# EAGLE design cerberus (EAGLE 7.5.0)
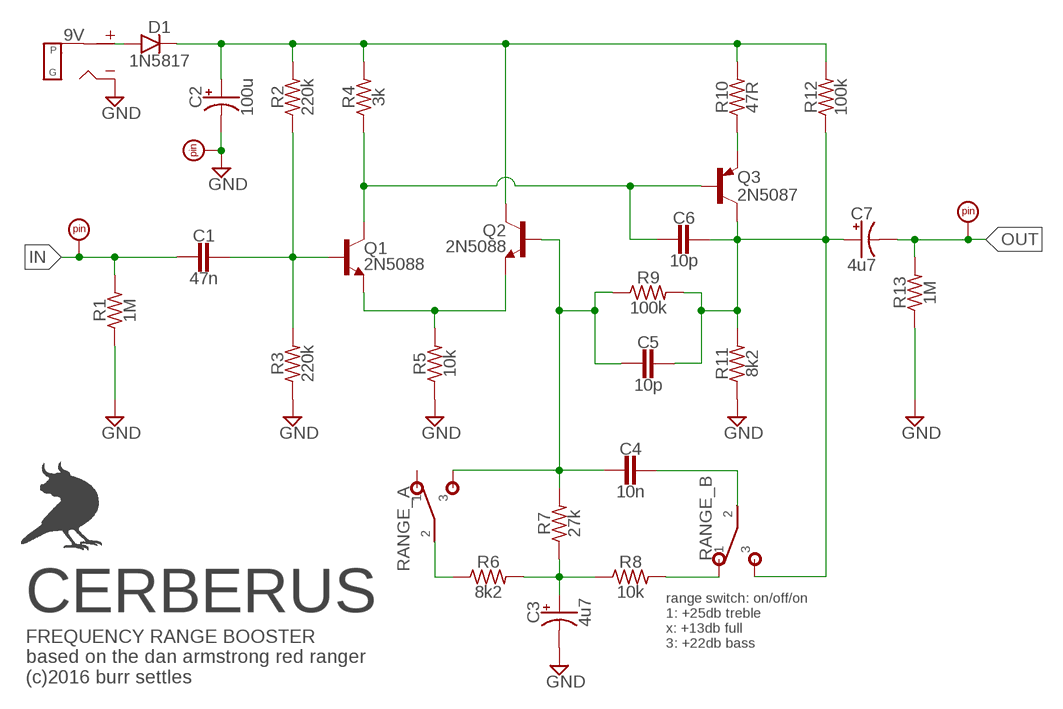
[diagram p0: schematic, sheet 1]

## Parts
9V  DC_MONO  [DC]
C1  47n  CER/FILMBOX.1  [BOX_SMALL]
C2  100u  0501  [050_020_1]
C3  4u7  0501  [050_020_1]
C4  10n  CER/FILMBOX.1  [BOX_SMALL]
C5  10p  CER/FILM2  [050X030_025_2]
C6  10p  CER/FILM2  [050X030_025_2]
C7  4u7  0501  [050_020_1]
D1  1N5817  DO41.3  [DO41-3]
GND  PADRND  [ROUND]
IN  PADSQR  [SQUARE]
OUT  PADSQR  [SQUARE]
Q1  2N5088  [TO92-]
Q2  2N5088  [TO92-]
Q3  2N5087  2N5087.1  [TO92-]
R1  1M  R_.3B  [R0207/3]
R2  220k  R_.3B  [R0207/3]
R3  220k  R_.3B  [R0207/3]
R4  3k  R_.3B  [R0207/3]
R5  10k  R_.3B  [R0207/3]
R6  8k2  R_.3B  [R0207/3]
R7  27k  R_.3B  [R0207/3]
R8  10k  R_.3B  [R0207/3]
R9  100k  R_.3B  [R0207/3]
R10  47R  R_.3B  [R0207/3]
R11  8k2  R_.3B  [R0207/3]
R12  100k  R_.3B  [R0207/3]
R13  1M  R_.3B  [R0207/3]
RANGE  DPDT  DPDTPADS  [DPDT_PADS]

## Nets
GND: 9V.S(SLEEVE) C2.- C3.- GND.1 R1.1 R3.1 R5.1 R11.1 R13.1
IN: C1.2 IN.1 R1.2
N$1: C1.1 Q1.2(B) R2.1 R3.2
N$2: Q3.3(E) R10.1
N$3: 9V.T(TIP) D1.A
N$4: C6.2 Q1.1(C) Q3.2(B) R4.1
N$5: Q1.3(E) Q2.3(E) R5.2
N$6: C5.1 C6.1 C7.+ Q3.1(C) R9.2 R11.2 R12.1 RANGE.P$6
N$7: C2.+ D1.C Q2.1(C) R2.2 R4.2 R10.2 R12.2
N$8: R6.1 RANGE.P$2
N$9: C4.1 RANGE.P$5
N$10: C4.2 C5.2 Q2.2(B) R7.2 R9.1 RANGE.P$3
N$12: C3.+ R6.2 R7.1 R8.1
N$14: R8.2 RANGE.P$4
OUT: C7.- OUT.1 R13.2
Unconnected: RANGE.P$1

## Notes on the sheet
- CERBERUS
- range switch: on/off/on
  1: +25db treble
  x: +13db full
  3: +22db bass
- FREQUENCY RANGE BOOSTER
  based on the dan armstrong red ranger
  (c)2016 burr settles

## Library data of the parts
9V = jacks:DC_MONO
C1 C4-C6 = capacitors-film:CER/FILM: 47 - 120pF Xicon Ceramic Disc 2.5mm lead spacing
C2 C3 C7 = capacitors-elec:050: 0.22 - 100uF Xicon values at Mouser.com: 10V: 10 - 100uF; 16V: 2.2 - 47uF; 25V: 0.47 - 47uF; 50V: 0.22 - 22uF
D1 = diodes:DO41: DO-41 Package Diodes: 1N4001 - 1N40019 Zener Diodes: 1N4728 - 1N4764
GND IN OUT = supply pins:PAD
Q1 Q2 = transistors:2N5088: NPN Transistor
Q3 = transistors:2N5087: PNP Transistor
R1-R13 = resistors:R_
RANGE = switches:DPDT

## Board
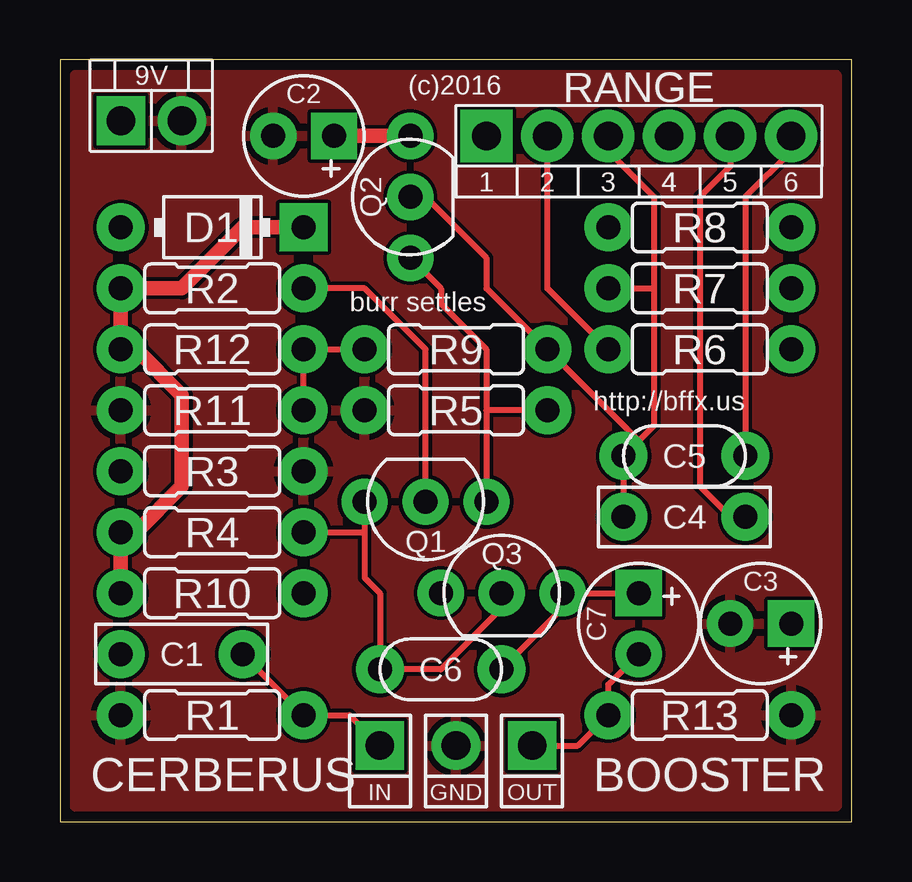
[diagram p1: board, top side]
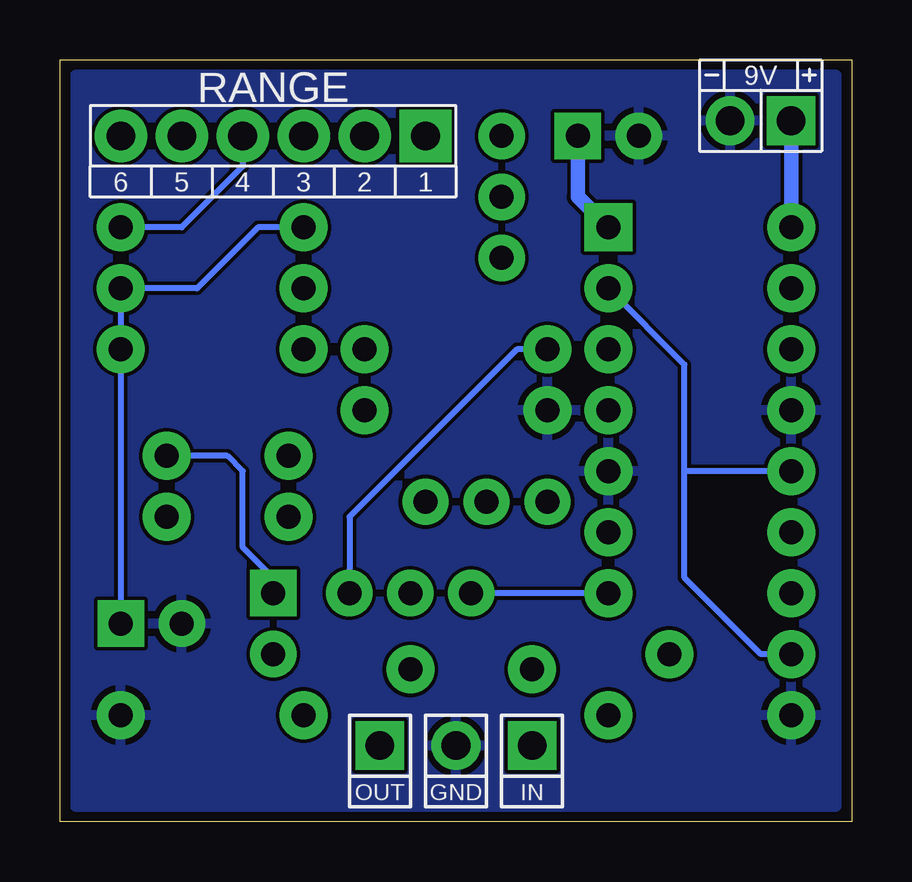
[diagram p2: board, bottom side, seen from below]

Size 33.02 x 31.74 mm. Coordinates in mm from the lower left corner, seen from the top.
Outline: 0,0 33.02,0 33.02,31.74 0,31.74 0,0
Copper layers (1*16): Top 0.0356mm / dielectric 1.5011mm / Bottom 0.0356mm
Design rules "oshpark-2layer": minimum track width 6mil, minimum drill 13mil, track to track 6mil, track to pad 6mil, pad to pad 6mil, via to via 6mil, smd to smd 6mil, copper to edge 15mil, drill to drill 6mil, minimum pad ring 7mil, minimum via ring 7mil, stop-mask expansion 2.5mil, vias tented up to drill 0mil, thermal gap 10mil

### Footprints (pad centres in the part's own frame; a part is rotated, then mirrored left to right if it is on the bottom)
DC = drill 1.2 pad 2.032: S -1.27,0 | drill 1.2 pad 2.032 square: T 1.27,0
BOX_SMALL = drill 1 pad 2: 1 -2.54,0; 2 2.54,0
050_020_1 = drill 1 pad 1.93 square: + -1.27,0 | drill 1 pad 1.93: - 1.27,0
050X030_025_2 = drill 1 pad 2: 1 -2.54,0; 2 2.54,0
DO41-3 = drill 1 pad 2: A 3.81,0 | drill 1 pad 2 square: C -3.81,0
ROUND = drill 1.2 pad 2.032: 1 0,0
SQUARE = drill 1.2 pad 2.032 square: 1 0,0
TO92- = drill 1 pad 1.93: 1 2.54,0; 2 0,0; 3 -2.54,0
R0207/3 = drill 1 pad 2: 1 -3.81,0; 2 3.81,0
DPDT_PADS = drill 1.2 pad 2.184 square: P$1 -6.35,0 | drill 1.2 pad 2.184: P$2 -3.81,0; P$3 -1.27,0; P$4 1.27,0; P$5 3.81,0; P$6 6.35,0

### Placement (x,y rotation side)
9V  3.81,29.21 0 bottom
C1  5.08,6.99 0 top
C2  10.16,28.57 180 top
C3  29.21,8.26 180 top
C4  26.04,12.7 180 top
C5  26.04,15.24 180 top
C6  15.88,6.35 180 top
C7  24.13,8.26 270 top
D1  6.35,24.77 180 top
GND  16.51,3.17 0 top
IN  13.34,3.17 0 top
OUT  19.68,3.17 0 top
Q1  15.24,13.34 180 top
Q2  14.61,26.04 90 top
Q3  18.41,9.53 0 top
R1  6.35,4.45 0 top
R2  6.35,22.23 180 top
R3  6.35,14.61 180 top
R4  6.35,12.06 180 top
R5  16.51,17.14 0 top
R6  26.67,19.68 0 top
R7  26.67,22.23 180 top
R8  26.67,24.77 0 top
R9  16.51,19.68 180 top
R10  6.35,9.53 180 top
R11  6.35,17.14 0 top
R12  6.35,19.68 180 top
R13  26.67,4.45 180 top
RANGE  24.13,28.57 0 top
U$1  [BF0150]  20.32,13.97 0 top

### Tracks (layer width: path | path; a pad name or v marks a point on that pad's centre or on a via)
GND
  pour Bottom: 0.64,31.11 32.38,31.11 32.38,0.64 0.64,0.64
  pour Top: 0.64,31.11 32.38,31.11 32.38,0.64 0.64,0.64
IN
  Top 0.254: C1.2 R1.2 12.06,4.45 IN.1
N$1
  Top 0.254: Q1.2 15.24,19.68 12.7,22.23 R2.1
  Bottom 0.254: C1.1 3.81,6.99 6.99,10.16 6.99,14.61 | 6.99,14.61 6.99,19.05 R2.1 | R3.2 6.99,14.61
N$2
  Bottom 0.254: R10.1 Q3.3
N$3
  Bottom 0.61: 9V.T D1.A
N$4
  Top 0.254: Q1.1 12.7,12.06 | 12.7,12.06 12.7,10.16 13.34,9.53 C6.2 15.88,6.35 18.41,8.89 Q3.2 | R4.1 12.7,12.06
N$5
  Top 0.254: Q2.3 15.88,22.23 15.88,21.59 17.78,19.68 17.78,17.14 | 17.78,17.14 Q1.3 | R5.2 17.78,17.14
N$6
  Top 0.254: C6.1 20.95,8.89 Q3.1 C7.+ | RANGE.P$6 30.48,27.94 28.57,26.04 C5.1 | R11.2 R12.1 R9.2
  Bottom 0.254: C7.+ 24.13,10.16 25.4,11.43 25.4,14.61 26.04,15.24 C5.1 | R9.2 13.97,19.68 20.95,12.7 Q3.1
N$7
  Top 0.61: C2.+ Q2.1 | R10.2 R4.2 3.17,12.06 5.08,13.97 5.08,17.78 3.17,19.68 R12.2 R2.2 5.08,22.23 7.62,24.77 D1.C
  Bottom 0.61: C2.+ 11.43,26.04 D1.C
N$8
  Top 0.254: R6.1 20.32,22.23 RANGE.P$2
N$9
  Top 0.254: RANGE.P$5 27.94,27.3 26.67,26.04 26.67,13.97 27.94,12.7 C4.1
N$10
  Top 0.254: Q2.2 15.24,26.04 17.78,23.5 17.78,22.23 R9.1 24.13,15.88 | RANGE.P$3 22.86,27.94 24.77,26.04 24.77,22.23 | 24.77,22.23 24.77,16.51 24.13,15.88 | 24.13,15.88 C5.2 C4.2 | R7.2 24.77,22.23
N$12
  Bottom 0.254: R8.1 24.77,24.77 27.3,22.23 R7.1 R6.2 C3.+
N$14
  Bottom 0.254: RANGE.P$4 25.4,27.3 27.94,24.77 R8.2
OUT
  Top 0.254: OUT.1 21.59,3.17 R13.2 22.86,5.71 C7.-

### Text on the board
tNames: (c)2016 | burr settles | http://bffx.us | CERBERUS | BOOSTER